# EAGLE design PolyPiezoProgrammer (EAGLE 9.5.2)
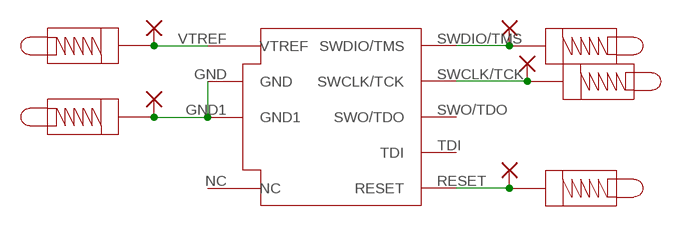
[diagram p0: schematic, sheet 1]

## Parts
PAD1  WIREPAD2,15/1,0  [2,15/1,0]
PAD2  WIREPAD2,15/1,0  [2,15/1,0]
PAD3  WIREPAD2,15/1,0  [2,15/1,0]
PAD4  WIREPAD2,15/1,0  [2,15/1,0]
PAD5  WIREPAD2,15/1,0  [2,15/1,0]
U$1  0930-0-15-20-75-14-11-0  [0930-0-15-20-75-14-11-0]
U$2  0930-0-15-20-75-14-11-0  [0930-0-15-20-75-14-11-0]
U$3  0930-0-15-20-75-14-11-0  [0930-0-15-20-75-14-11-0]
U$4  0930-0-15-20-75-14-11-0  [0930-0-15-20-75-14-11-0]
U$5  0930-0-15-20-75-14-11-0  [0930-0-15-20-75-14-11-0]
U$6  JLINK_IF  [JLINK_IF]

## Nets
N$1: PAD2.1(P) U$1.P$1 U$6.VTREF
N$2: PAD1.1(P) U$2.P$1 U$6.GND U$6.GND1
N$3: PAD5.1(P) U$3.P$1 U$6.SWDIO/TMS
N$4: PAD4.1(P) U$4.P$1 U$6.SWCLK/TCK
N$5: PAD3.1(P) U$5.P$1 U$6.RESET
Unconnected: U$6.NC U$6.SWO/TDO U$6.TDI

## Library data of the parts
PAD1-PAD5 = wirepad:WIREPAD: Wire PAD connect wire on PCB
U$1-U$5 = pogo_pin:0930-0-15-20-75-14-11-0
U$6 = JLink_IF:JLINK_IF

## Board
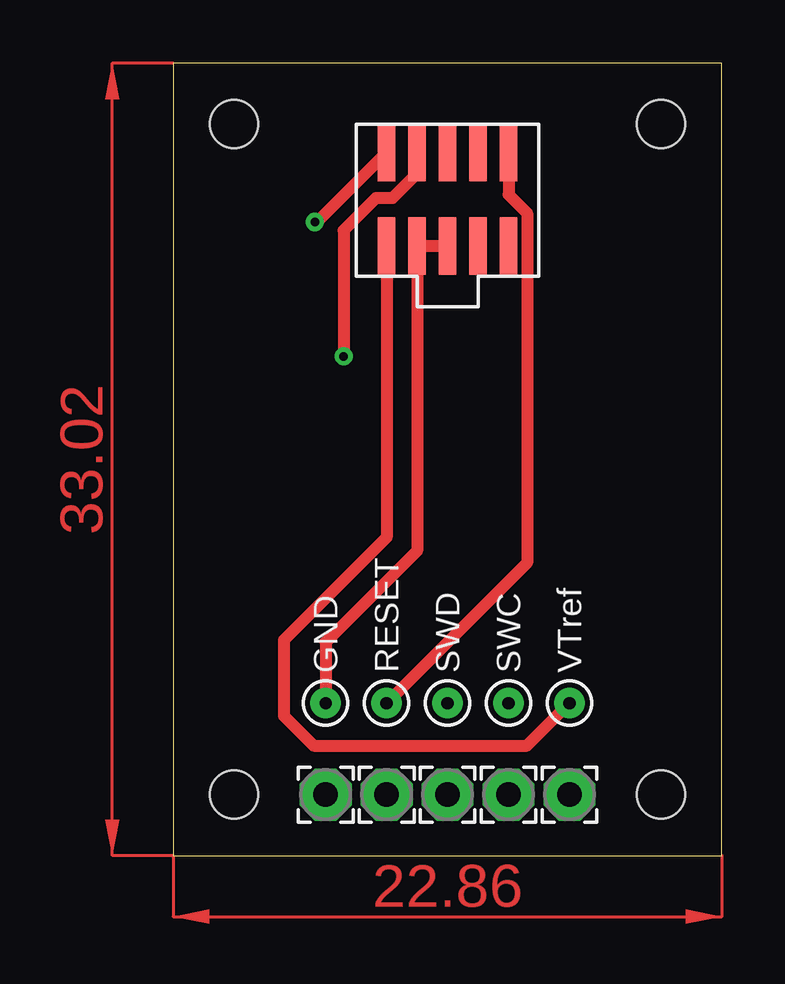
[diagram p1: board, top side]
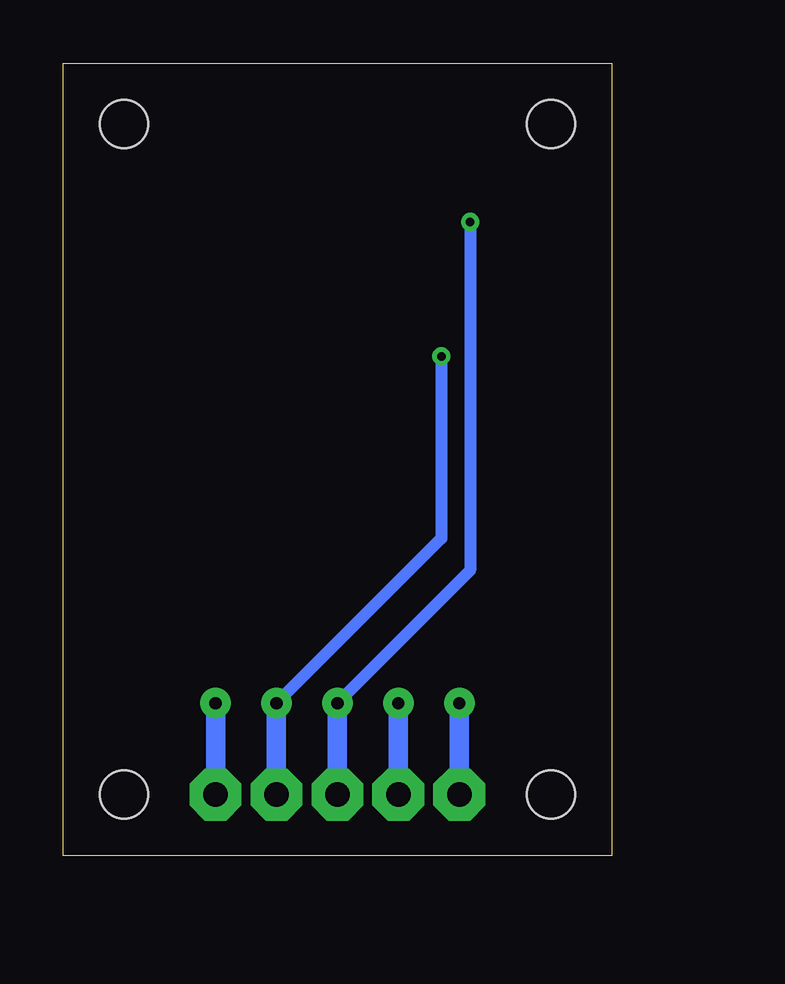
[diagram p2: board, bottom side, seen from below]

Size 22.86 x 33.02 mm. Coordinates in mm from the lower left corner, seen from the top.
Outline: 0,0 22.86,0 22.86,33.02 0,33.02 0,0
Copper layers (1*16): Top 0.035mm / dielectric 1.5mm / Bottom 0.035mm
Design rules "default": minimum track width 6mil, minimum drill 0.35mm, track to track 6mil, track to pad 6mil, pad to pad 6mil, via to via 6mil, smd to smd 6mil, copper to edge 40mil, drill to drill 6mil, minimum pad ring 10mil, minimum via ring 8mil, stop-mask expansion 4mil, vias tented up to drill 0mil, thermal gap 10mil
Holes 2 mm at 2.54,2.54 20.32,2.54 20.32,30.48 2.54,30.48

### Footprints (pad centres in the part's own frame; a part is rotated, then mirrored left to right if it is on the bottom)
2,15/1,0 = drill 1.016 pad 2.159 octagon: 1 0,0
0930-0-15-20-75-14-11-0 = drill 0.508 pad 1.27: P$1 0,0
JLINK_IF = smd 2.4 x 0.74: GND 0,-1.27; GND1 0,-2.54; NC 0,-3.81; NC1 0,-5.08; RESET 3.9,-5.08; SWCLK/TCK 3.9,-1.27; SWDIO/TMS 3.9,0; SWO/TDO 3.9,-2.54; TDI 3.9,-3.81; VTREF 0,0

### Placement (x,y rotation side)
PAD1  6.35,2.54 0 top
PAD2  16.51,2.54 0 top
PAD3  8.89,2.54 0 top
PAD4  13.97,2.54 0 top
PAD5  11.43,2.54 0 top
U$1  16.51,6.35 0 top
U$2  6.35,6.35 0 top
U$3  11.43,6.35 0 top
U$4  13.97,6.35 0 top
U$5  8.89,6.35 0 top
U$6  8.89,25.4 90 top

### Tracks (layer width: path | path; a pad name or v marks a point on that pad's centre or on a via)
N$1
  Top 0.508: U$6.VTREF 8.89,13.26 4.61,8.98 4.61,5.82 5.85,4.58 14.74,4.58 U$1.P$1
  Bottom 0.813: PAD2.1 U$1.P$1
N$2
  Top 0.508: U$6.GND1 U$6.GND 10.16,12.7 6.35,8.89 U$2.P$1
  Bottom 0.813: PAD1.1 U$2.P$1
N$3  (via drill 0.35)
  Top 0.508: U$6.SWDIO/TMS 5.99,26.4 v5.9,26.4
  Bottom 0.508: v5.9,26.4 5.9,11.88 U$3.P$1
  Bottom 0.813: PAD5.1 U$3.P$1
N$4  (via drill 0.35)
  Top 0.508: U$6.SWCLK/TCK 10.17,28.43 9.13,27.39 8.44,27.39 7.1,26.05 v7.1,20.8
  Bottom 0.508: v7.1,20.8 7.1,13.22 U$4.P$1
  Bottom 0.813: PAD4.1 U$4.P$1
N$5
  Top 0.508: U$6.RESET 13.97,27.55 14.75,26.77 14.75,12.21 U$5.P$1
  Bottom 0.813: PAD3.1 U$5.P$1
(copper drawn outside any net)
  shapes: Top area x2

### Text on the board
tPlace: GND | RESET | SWD | SWC | VTref